# Altium schematic sheet 24. SOC DIGITAL POWER 3.SchDoc: SOC - DIGITAL POWER 3 (part 4 of 5)
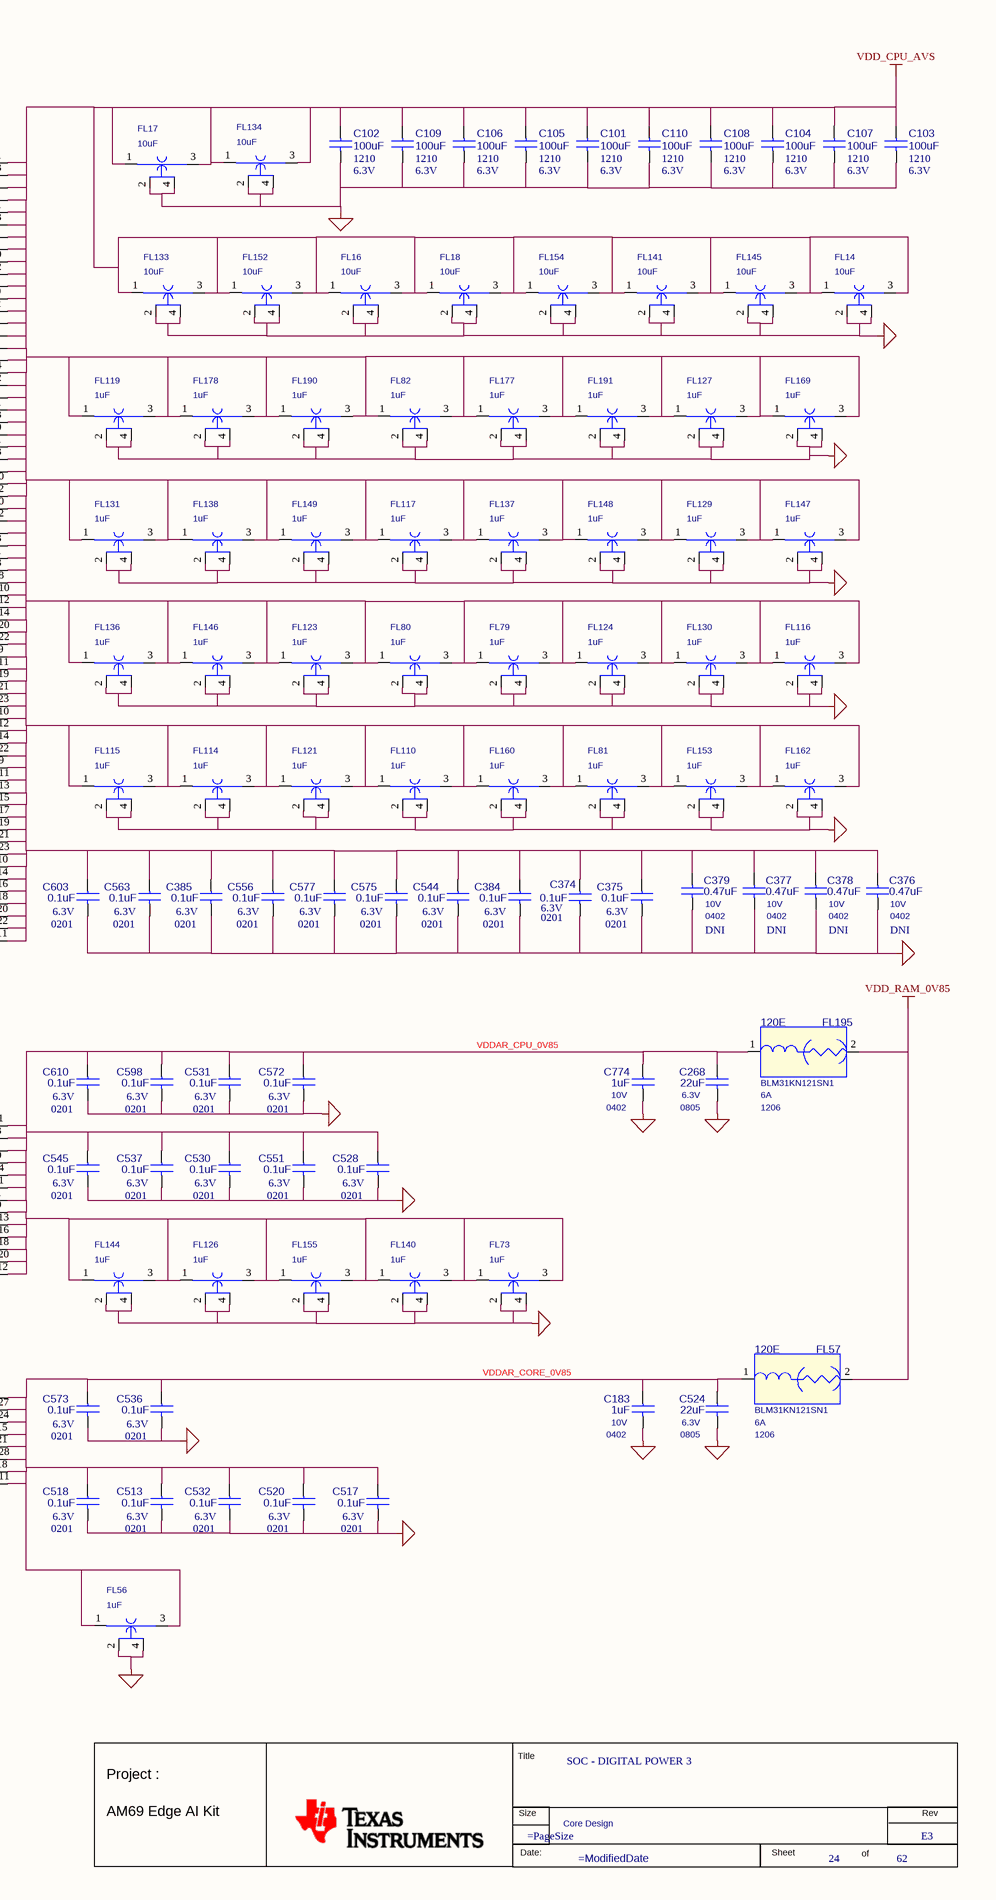
[diagram p4: 24. SOC DIGITAL POWER 3.SchDoc, right]

## Library data of the parts (continued)
FL108 = CAP_NFM_TI: PASSIVE FILTER EMI 1uF 4V AUTO 0402; Part Reference: FL108; Mfr_part_number: NFM15HC105D0G_TI; Mfr_name: MURATA; Mistral Part No: 130018100050; Custom_Duty: 15%; Customs_HS_Code: 85412900; Wattage: NA; Project: TI_J7ES_EVM_SOM; Value: 1uF; Footprint Path: Y:\MIS_DATABASE\Library\ALTIUM_TOOL\PCB_FOOTPRINTS\Altium_Footprint_Lib.PcbLib; Library Path: Y:\MIS_DATABASE\Library\ALTIUM_TOOL\SCHEMATICS_PARTS\MS_FILTER_Library.schlib; MECHANICAL 3D STEP FILE: EMIFIL_NFM15CC_0402_0-5_TI; RoHS: NA; Chkd/date: MANIRAJA/251018; Crtd /date: ALVY/251018; Datasheet: Y:\MIS_DATABASE\DATASHEETS\DISCRETES\INDUCTORS\NFM15CC223C1A3.PDF; Temperature: NA; Weight: NA; Height: 0.50MM; PCB Footprint: EMIFIL_NFM15CC_0402_0-5_TI; Library Ref: CAP_NFM_TI; Distributor_part_number: NA; Distributor_name: NA; Package: 0402; Voltage: 4V; Tolerance: NA; Part_type: FILTER; Footprint Ref: EMIFIL_NFM15CC_0402_0-5_TI
FL109 = CAP_NFM_TI: PASSIVE FILTER EMI 1uF 4V AUTO 0402; Part Reference: FL109; Mfr_part_number: NFM15HC105D0G_TI; Mfr_name: MURATA; Mistral Part No: 130018100050; Custom_Duty: 15%; Customs_HS_Code: 85412900; Wattage: NA; Project: TI_J7ES_EVM_SOM; Value: 1uF; Footprint Path: Y:\MIS_DATABASE\Library\ALTIUM_TOOL\PCB_FOOTPRINTS\Altium_Footprint_Lib.PcbLib; Library Path: Y:\MIS_DATABASE\Library\ALTIUM_TOOL\SCHEMATICS_PARTS\MS_FILTER_Library.schlib; MECHANICAL 3D STEP FILE: EMIFIL_NFM15CC_0402_0-5_TI; RoHS: NA; Chkd/date: MANIRAJA/251018; Crtd /date: ALVY/251018; Datasheet: Y:\MIS_DATABASE\DATASHEETS\DISCRETES\INDUCTORS\NFM15CC223C1A3.PDF; Temperature: NA; Weight: NA; Height: 0.50MM; PCB Footprint: EMIFIL_NFM15CC_0402_0-5_TI; Library Ref: CAP_NFM_TI; Distributor_part_number: NA; Distributor_name: NA; Package: 0402; Voltage: 4V; Tolerance: NA; Part_type: FILTER; Footprint Ref: EMIFIL_NFM15CC_0402_0-5_TI
FL110 = CAP_NFM_TI: PASSIVE FILTER EMI 1uF 4V AUTO 0402; Part Reference: FL110; Mfr_part_number: NFM15HC105D0G_TI; Mfr_name: MURATA; Mistral Part No: 130018100050; Custom_Duty: 15%; Customs_HS_Code: 85412900; Wattage: NA; Project: TI_J7ES_EVM_SOM; Value: 1uF; Footprint Path: Y:\MIS_DATABASE\Library\ALTIUM_TOOL\PCB_FOOTPRINTS\Altium_Footprint_Lib.PcbLib; Library Path: Y:\MIS_DATABASE\Library\ALTIUM_TOOL\SCHEMATICS_PARTS\MS_FILTER_Library.schlib; MECHANICAL 3D STEP FILE: EMIFIL_NFM15CC_0402_0-5_TI; RoHS: NA; Chkd/date: MANIRAJA/251018; Crtd /date: ALVY/251018; Datasheet: Y:\MIS_DATABASE\DATASHEETS\DISCRETES\INDUCTORS\NFM15CC223C1A3.PDF; Temperature: NA; Weight: NA; Height: 0.50MM; PCB Footprint: EMIFIL_NFM15CC_0402_0-5_TI; Library Ref: CAP_NFM_TI; Distributor_part_number: NA; Distributor_name: NA; Package: 0402; Voltage: 4V; Tolerance: NA; Part_type: FILTER; Footprint Ref: EMIFIL_NFM15CC_0402_0-5_TI
FL111 = CAP_NFM_TI: PASSIVE FILTER EMI 1uF 4V AUTO 0402; Part Reference: FL111; Mfr_part_number: NFM15HC105D0G_TI; Mfr_name: MURATA; Mistral Part No: 130018100050; Custom_Duty: 15%; Customs_HS_Code: 85412900; Wattage: NA; Project: TI_J7ES_EVM_SOM; Value: 1uF; Footprint Path: Y:\MIS_DATABASE\Library\ALTIUM_TOOL\PCB_FOOTPRINTS\Altium_Footprint_Lib.PcbLib; Library Path: Y:\MIS_DATABASE\Library\ALTIUM_TOOL\SCHEMATICS_PARTS\MS_FILTER_Library.schlib; MECHANICAL 3D STEP FILE: EMIFIL_NFM15CC_0402_0-5_TI; RoHS: NA; Chkd/date: MANIRAJA/251018; Crtd /date: ALVY/251018; Datasheet: Y:\MIS_DATABASE\DATASHEETS\DISCRETES\INDUCTORS\NFM15CC223C1A3.PDF; Temperature: NA; Weight: NA; Height: 0.50MM; PCB Footprint: EMIFIL_NFM15CC_0402_0-5_TI; Library Ref: CAP_NFM_TI; Distributor_part_number: NA; Distributor_name: NA; Package: 0402; Voltage: 4V; Tolerance: NA; Part_type: FILTER; Footprint Ref: EMIFIL_NFM15CC_0402_0-5_TI
FL112 = CAP_NFM_TI: PASSIVE FILTER EMI 1uF 4V AUTO 0402; Part Reference: FL112; Mfr_part_number: NFM15HC105D0G_TI; Mfr_name: MURATA; Mistral Part No: 130018100050; Custom_Duty: 15%; Customs_HS_Code: 85412900; Wattage: NA; Project: TI_J7ES_EVM_SOM; Value: 1uF; Footprint Path: Y:\MIS_DATABASE\Library\ALTIUM_TOOL\PCB_FOOTPRINTS\Altium_Footprint_Lib.PcbLib; Library Path: Y:\MIS_DATABASE\Library\ALTIUM_TOOL\SCHEMATICS_PARTS\MS_FILTER_Library.schlib; MECHANICAL 3D STEP FILE: EMIFIL_NFM15CC_0402_0-5_TI; RoHS: NA; Chkd/date: MANIRAJA/251018; Crtd /date: ALVY/251018; Datasheet: Y:\MIS_DATABASE\DATASHEETS\DISCRETES\INDUCTORS\NFM15CC223C1A3.PDF; Temperature: NA; Weight: NA; Height: 0.50MM; PCB Footprint: EMIFIL_NFM15CC_0402_0-5_TI; Library Ref: CAP_NFM_TI; Distributor_part_number: NA; Distributor_name: NA; Package: 0402; Voltage: 4V; Tolerance: NA; Part_type: FILTER; Footprint Ref: EMIFIL_NFM15CC_0402_0-5_TI
FL113 = CAP_NFM_TI: PASSIVE FILTER EMI 1uF 4V AUTO 0402; Part Reference: FL113; Mfr_part_number: NFM15HC105D0G_TI; Mfr_name: MURATA; Mistral Part No: 130018100050; Custom_Duty: 15%; Customs_HS_Code: 85412900; Wattage: NA; Project: TI_J7ES_EVM_SOM; Value: 1uF; Footprint Path: Y:\MIS_DATABASE\Library\ALTIUM_TOOL\PCB_FOOTPRINTS\Altium_Footprint_Lib.PcbLib; Library Path: Y:\MIS_DATABASE\Library\ALTIUM_TOOL\SCHEMATICS_PARTS\MS_FILTER_Library.schlib; MECHANICAL 3D STEP FILE: EMIFIL_NFM15CC_0402_0-5_TI; RoHS: NA; Chkd/date: MANIRAJA/251018; Crtd /date: ALVY/251018; Datasheet: Y:\MIS_DATABASE\DATASHEETS\DISCRETES\INDUCTORS\NFM15CC223C1A3.PDF; Temperature: NA; Weight: NA; Height: 0.50MM; PCB Footprint: EMIFIL_NFM15CC_0402_0-5_TI; Library Ref: CAP_NFM_TI; Distributor_part_number: NA; Distributor_name: NA; Package: 0402; Voltage: 4V; Tolerance: NA; Part_type: FILTER; Footprint Ref: EMIFIL_NFM15CC_0402_0-5_TI
FL114 = CAP_NFM_TI: PASSIVE FILTER EMI 1uF 4V AUTO 0402; Part Reference: FL114; Mfr_part_number: NFM15HC105D0G_TI; Mfr_name: MURATA; Mistral Part No: 130018100050; Custom_Duty: 15%; Customs_HS_Code: 85412900; Wattage: NA; Project: TI_J7ES_EVM_SOM; Value: 1uF; Footprint Path: Y:\MIS_DATABASE\Library\ALTIUM_TOOL\PCB_FOOTPRINTS\Altium_Footprint_Lib.PcbLib; Library Path: Y:\MIS_DATABASE\Library\ALTIUM_TOOL\SCHEMATICS_PARTS\MS_FILTER_Library.schlib; MECHANICAL 3D STEP FILE: EMIFIL_NFM15CC_0402_0-5_TI; RoHS: NA; Chkd/date: MANIRAJA/251018; Crtd /date: ALVY/251018; Datasheet: Y:\MIS_DATABASE\DATASHEETS\DISCRETES\INDUCTORS\NFM15CC223C1A3.PDF; Temperature: NA; Weight: NA; Height: 0.50MM; PCB Footprint: EMIFIL_NFM15CC_0402_0-5_TI; Library Ref: CAP_NFM_TI; Distributor_part_number: NA; Distributor_name: NA; Package: 0402; Voltage: 4V; Tolerance: NA; Part_type: FILTER; Footprint Ref: EMIFIL_NFM15CC_0402_0-5_TI
FL115 = CAP_NFM_TI: PASSIVE FILTER EMI 1uF 4V AUTO 0402; Part Reference: FL115; Mfr_part_number: NFM15HC105D0G_TI; Mfr_name: MURATA; Mistral Part No: 130018100050; Custom_Duty: 15%; Customs_HS_Code: 85412900; Wattage: NA; Project: TI_J7ES_EVM_SOM; Value: 1uF; Footprint Path: Y:\MIS_DATABASE\Library\ALTIUM_TOOL\PCB_FOOTPRINTS\Altium_Footprint_Lib.PcbLib; Library Path: Y:\MIS_DATABASE\Library\ALTIUM_TOOL\SCHEMATICS_PARTS\MS_FILTER_Library.schlib; MECHANICAL 3D STEP FILE: EMIFIL_NFM15CC_0402_0-5_TI; RoHS: NA; Chkd/date: MANIRAJA/251018; Crtd /date: ALVY/251018; Datasheet: Y:\MIS_DATABASE\DATASHEETS\DISCRETES\INDUCTORS\NFM15CC223C1A3.PDF; Temperature: NA; Weight: NA; Height: 0.50MM; PCB Footprint: EMIFIL_NFM15CC_0402_0-5_TI; Library Ref: CAP_NFM_TI; Distributor_part_number: NA; Distributor_name: NA; Package: 0402; Voltage: 4V; Tolerance: NA; Part_type: FILTER; Footprint Ref: EMIFIL_NFM15CC_0402_0-5_TI
FL116 = CAP_NFM_TI: PASSIVE FILTER EMI 1uF 4V AUTO 0402; Part Reference: FL116; Mfr_part_number: NFM15HC105D0G_TI; Mfr_name: MURATA; Mistral Part No: 130018100050; Custom_Duty: 15%; Customs_HS_Code: 85412900; Wattage: NA; Project: TI_J7ES_EVM_SOM; Value: 1uF; Footprint Path: Y:\MIS_DATABASE\Library\ALTIUM_TOOL\PCB_FOOTPRINTS\Altium_Footprint_Lib.PcbLib; Library Path: Y:\MIS_DATABASE\Library\ALTIUM_TOOL\SCHEMATICS_PARTS\MS_FILTER_Library.schlib; MECHANICAL 3D STEP FILE: EMIFIL_NFM15CC_0402_0-5_TI; RoHS: NA; Chkd/date: MANIRAJA/251018; Crtd /date: ALVY/251018; Datasheet: Y:\MIS_DATABASE\DATASHEETS\DISCRETES\INDUCTORS\NFM15CC223C1A3.PDF; Temperature: NA; Weight: NA; Height: 0.50MM; PCB Footprint: EMIFIL_NFM15CC_0402_0-5_TI; Library Ref: CAP_NFM_TI; Distributor_part_number: NA; Distributor_name: NA; Package: 0402; Voltage: 4V; Tolerance: NA; Part_type: FILTER; Footprint Ref: EMIFIL_NFM15CC_0402_0-5_TI
FL117 = CAP_NFM_TI: PASSIVE FILTER EMI 1uF 4V AUTO 0402; Part Reference: FL117; Mfr_part_number: NFM15HC105D0G_TI; Mfr_name: MURATA; Mistral Part No: 130018100050; Custom_Duty: 15%; Customs_HS_Code: 85412900; Wattage: NA; Project: TI_J7ES_EVM_SOM; Value: 1uF; Footprint Path: Y:\MIS_DATABASE\Library\ALTIUM_TOOL\PCB_FOOTPRINTS\Altium_Footprint_Lib.PcbLib; Library Path: Y:\MIS_DATABASE\Library\ALTIUM_TOOL\SCHEMATICS_PARTS\MS_FILTER_Library.schlib; MECHANICAL 3D STEP FILE: EMIFIL_NFM15CC_0402_0-5_TI; RoHS: NA; Chkd/date: MANIRAJA/251018; Crtd /date: ALVY/251018; Datasheet: Y:\MIS_DATABASE\DATASHEETS\DISCRETES\INDUCTORS\NFM15CC223C1A3.PDF; Temperature: NA; Weight: NA; Height: 0.50MM; PCB Footprint: EMIFIL_NFM15CC_0402_0-5_TI; Library Ref: CAP_NFM_TI; Distributor_part_number: NA; Distributor_name: NA; Package: 0402; Voltage: 4V; Tolerance: NA; Part_type: FILTER; Footprint Ref: EMIFIL_NFM15CC_0402_0-5_TI
FL118 = CAP_NFM_TI: PASSIVE FILTER EMI 1uF 4V AUTO 0402; Part Reference: FL118; Mfr_part_number: NFM15HC105D0G_TI; Mfr_name: MURATA; Mistral Part No: 130018100050; Custom_Duty: 15%; Customs_HS_Code: 85412900; Wattage: NA; Project: TI_J7ES_EVM_SOM; Value: 1uF; Footprint Path: Y:\MIS_DATABASE\Library\ALTIUM_TOOL\PCB_FOOTPRINTS\Altium_Footprint_Lib.PcbLib; Library Path: Y:\MIS_DATABASE\Library\ALTIUM_TOOL\SCHEMATICS_PARTS\MS_FILTER_Library.schlib; MECHANICAL 3D STEP FILE: EMIFIL_NFM15CC_0402_0-5_TI; RoHS: NA; Chkd/date: MANIRAJA/251018; Crtd /date: ALVY/251018; Datasheet: Y:\MIS_DATABASE\DATASHEETS\DISCRETES\INDUCTORS\NFM15CC223C1A3.PDF; Temperature: NA; Weight: NA; Height: 0.50MM; PCB Footprint: EMIFIL_NFM15CC_0402_0-5_TI; Library Ref: CAP_NFM_TI; Distributor_part_number: NA; Distributor_name: NA; Package: 0402; Voltage: 4V; Tolerance: NA; Part_type: FILTER; Footprint Ref: EMIFIL_NFM15CC_0402_0-5_TI
FL119 = CAP_NFM_TI: PASSIVE FILTER EMI 1uF 4V AUTO 0402; Part Reference: FL119; Mfr_part_number: NFM15HC105D0G_TI; Mfr_name: MURATA; Mistral Part No: 130018100050; Custom_Duty: 15%; Customs_HS_Code: 85412900; Wattage: NA; Project: TI_J7ES_EVM_SOM; Value: 1uF; Footprint Path: Y:\MIS_DATABASE\Library\ALTIUM_TOOL\PCB_FOOTPRINTS\Altium_Footprint_Lib.PcbLib; Library Path: Y:\MIS_DATABASE\Library\ALTIUM_TOOL\SCHEMATICS_PARTS\MS_FILTER_Library.schlib; MECHANICAL 3D STEP FILE: EMIFIL_NFM15CC_0402_0-5_TI; RoHS: NA; Chkd/date: MANIRAJA/251018; Crtd /date: ALVY/251018; Datasheet: Y:\MIS_DATABASE\DATASHEETS\DISCRETES\INDUCTORS\NFM15CC223C1A3.PDF; Temperature: NA; Weight: NA; Height: 0.50MM; PCB Footprint: EMIFIL_NFM15CC_0402_0-5_TI; Library Ref: CAP_NFM_TI; Distributor_part_number: NA; Distributor_name: NA; Package: 0402; Voltage: 4V; Tolerance: NA; Part_type: FILTER; Footprint Ref: EMIFIL_NFM15CC_0402_0-5_TI
FL120 = CAP_NFM_TI: PASSIVE FILTER EMI 1uF 4V AUTO 0402; Part Reference: FL120; Mfr_part_number: NFM15HC105D0G_TI; Mfr_name: MURATA; Mistral Part No: 130018100050; Custom_Duty: 15%; Customs_HS_Code: 85412900; Wattage: NA; Project: TI_J7ES_EVM_SOM; Value: 1uF; Footprint Path: Y:\MIS_DATABASE\Library\ALTIUM_TOOL\PCB_FOOTPRINTS\Altium_Footprint_Lib.PcbLib; Library Path: Y:\MIS_DATABASE\Library\ALTIUM_TOOL\SCHEMATICS_PARTS\MS_FILTER_Library.schlib; MECHANICAL 3D STEP FILE: EMIFIL_NFM15CC_0402_0-5_TI; RoHS: NA; Chkd/date: MANIRAJA/251018; Crtd /date: ALVY/251018; Datasheet: Y:\MIS_DATABASE\DATASHEETS\DISCRETES\INDUCTORS\NFM15CC223C1A3.PDF; Temperature: NA; Weight: NA; Height: 0.50MM; PCB Footprint: EMIFIL_NFM15CC_0402_0-5_TI; Library Ref: CAP_NFM_TI; Distributor_part_number: NA; Distributor_name: NA; Package: 0402; Voltage: 4V; Tolerance: NA; Part_type: FILTER; Footprint Ref: EMIFIL_NFM15CC_0402_0-5_TI
FL121 = CAP_NFM_TI: PASSIVE FILTER EMI 1uF 4V AUTO 0402; Part Reference: FL121; Mfr_part_number: NFM15HC105D0G_TI; Mfr_name: MURATA; Mistral Part No: 130018100050; Custom_Duty: 15%; Customs_HS_Code: 85412900; Wattage: NA; Project: TI_J7ES_EVM_SOM; Value: 1uF; Footprint Path: Y:\MIS_DATABASE\Library\ALTIUM_TOOL\PCB_FOOTPRINTS\Altium_Footprint_Lib.PcbLib; Library Path: Y:\MIS_DATABASE\Library\ALTIUM_TOOL\SCHEMATICS_PARTS\MS_FILTER_Library.schlib; MECHANICAL 3D STEP FILE: EMIFIL_NFM15CC_0402_0-5_TI; RoHS: NA; Chkd/date: MANIRAJA/251018; Crtd /date: ALVY/251018; Datasheet: Y:\MIS_DATABASE\DATASHEETS\DISCRETES\INDUCTORS\NFM15CC223C1A3.PDF; Temperature: NA; Weight: NA; Height: 0.50MM; PCB Footprint: EMIFIL_NFM15CC_0402_0-5_TI; Library Ref: CAP_NFM_TI; Distributor_part_number: NA; Distributor_name: NA; Package: 0402; Voltage: 4V; Tolerance: NA; Part_type: FILTER; Footprint Ref: EMIFIL_NFM15CC_0402_0-5_TI
FL122 = CAP_NFM_TI: PASSIVE FILTER EMI 1uF 4V AUTO 0402; Part Reference: FL122; Mfr_part_number: NFM15HC105D0G_TI; Mfr_name: MURATA; Mistral Part No: 130018100050; Custom_Duty: 15%; Customs_HS_Code: 85412900; Wattage: NA; Project: TI_J7ES_EVM_SOM; Value: 1uF; Footprint Path: Y:\MIS_DATABASE\Library\ALTIUM_TOOL\PCB_FOOTPRINTS\Altium_Footprint_Lib.PcbLib; Library Path: Y:\MIS_DATABASE\Library\ALTIUM_TOOL\SCHEMATICS_PARTS\MS_FILTER_Library.schlib; MECHANICAL 3D STEP FILE: EMIFIL_NFM15CC_0402_0-5_TI; RoHS: NA; Chkd/date: MANIRAJA/251018; Crtd /date: ALVY/251018; Datasheet: Y:\MIS_DATABASE\DATASHEETS\DISCRETES\INDUCTORS\NFM15CC223C1A3.PDF; Temperature: NA; Weight: NA; Height: 0.50MM; PCB Footprint: EMIFIL_NFM15CC_0402_0-5_TI; Library Ref: CAP_NFM_TI; Distributor_part_number: NA; Distributor_name: NA; Package: 0402; Voltage: 4V; Tolerance: NA; Part_type: FILTER; Footprint Ref: EMIFIL_NFM15CC_0402_0-5_TI
FL123 = CAP_NFM_TI: PASSIVE FILTER EMI 1uF 4V AUTO 0402; Part Reference: FL123; Mfr_part_number: NFM15HC105D0G_TI; Mfr_name: MURATA; Mistral Part No: 130018100050; Custom_Duty: 15%; Customs_HS_Code: 85412900; Wattage: NA; Project: TI_J7ES_EVM_SOM; Value: 1uF; Footprint Path: Y:\MIS_DATABASE\Library\ALTIUM_TOOL\PCB_FOOTPRINTS\Altium_Footprint_Lib.PcbLib; Library Path: Y:\MIS_DATABASE\Library\ALTIUM_TOOL\SCHEMATICS_PARTS\MS_FILTER_Library.schlib; MECHANICAL 3D STEP FILE: EMIFIL_NFM15CC_0402_0-5_TI; RoHS: NA; Chkd/date: MANIRAJA/251018; Crtd /date: ALVY/251018; Datasheet: Y:\MIS_DATABASE\DATASHEETS\DISCRETES\INDUCTORS\NFM15CC223C1A3.PDF; Temperature: NA; Weight: NA; Height: 0.50MM; PCB Footprint: EMIFIL_NFM15CC_0402_0-5_TI; Library Ref: CAP_NFM_TI; Distributor_part_number: NA; Distributor_name: NA; Package: 0402; Voltage: 4V; Tolerance: NA; Part_type: FILTER; Footprint Ref: EMIFIL_NFM15CC_0402_0-5_TI
FL124 = CAP_NFM_TI: PASSIVE FILTER EMI 1uF 4V AUTO 0402; Part Reference: FL124; Mfr_part_number: NFM15HC105D0G_TI; Mfr_name: MURATA; Mistral Part No: 130018100050; Custom_Duty: 15%; Customs_HS_Code: 85412900; Wattage: NA; Project: TI_J7ES_EVM_SOM; Value: 1uF; Footprint Path: Y:\MIS_DATABASE\Library\ALTIUM_TOOL\PCB_FOOTPRINTS\Altium_Footprint_Lib.PcbLib; Library Path: Y:\MIS_DATABASE\Library\ALTIUM_TOOL\SCHEMATICS_PARTS\MS_FILTER_Library.schlib; MECHANICAL 3D STEP FILE: EMIFIL_NFM15CC_0402_0-5_TI; RoHS: NA; Chkd/date: MANIRAJA/251018; Crtd /date: ALVY/251018; Datasheet: Y:\MIS_DATABASE\DATASHEETS\DISCRETES\INDUCTORS\NFM15CC223C1A3.PDF; Temperature: NA; Weight: NA; Height: 0.50MM; PCB Footprint: EMIFIL_NFM15CC_0402_0-5_TI; Library Ref: CAP_NFM_TI; Distributor_part_number: NA; Distributor_name: NA; Package: 0402; Voltage: 4V; Tolerance: NA; Part_type: FILTER; Footprint Ref: EMIFIL_NFM15CC_0402_0-5_TI
FL125 = CAP_NFM_TI: PASSIVE FILTER EMI 1uF 4V AUTO 0402; Part Reference: FL125; Mfr_part_number: NFM15HC105D0G_TI; Mfr_name: MURATA; Mistral Part No: 130018100050; Custom_Duty: 15%; Customs_HS_Code: 85412900; Wattage: NA; Project: TI_J7ES_EVM_SOM; Value: 1uF; Footprint Path: Y:\MIS_DATABASE\Library\ALTIUM_TOOL\PCB_FOOTPRINTS\Altium_Footprint_Lib.PcbLib; Library Path: Y:\MIS_DATABASE\Library\ALTIUM_TOOL\SCHEMATICS_PARTS\MS_FILTER_Library.schlib; MECHANICAL 3D STEP FILE: EMIFIL_NFM15CC_0402_0-5_TI; RoHS: NA; Chkd/date: MANIRAJA/251018; Crtd /date: ALVY/251018; Datasheet: Y:\MIS_DATABASE\DATASHEETS\DISCRETES\INDUCTORS\NFM15CC223C1A3.PDF; Temperature: NA; Weight: NA; Height: 0.50MM; PCB Footprint: EMIFIL_NFM15CC_0402_0-5_TI; Library Ref: CAP_NFM_TI; Distributor_part_number: NA; Distributor_name: NA; Package: 0402; Voltage: 4V; Tolerance: NA; Part_type: FILTER; Footprint Ref: EMIFIL_NFM15CC_0402_0-5_TI
FL126 = CAP_NFM_TI: PASSIVE FILTER EMI 1uF 4V AUTO 0402; Part Reference: FL126; Mfr_part_number: NFM15HC105D0G_TI; Mfr_name: MURATA; Mistral Part No: 130018100050; Custom_Duty: 15%; Customs_HS_Code: 85412900; Wattage: NA; Project: TI_J7ES_EVM_SOM; Value: 1uF; Footprint Path: Y:\MIS_DATABASE\Library\ALTIUM_TOOL\PCB_FOOTPRINTS\Altium_Footprint_Lib.PcbLib; Library Path: Y:\MIS_DATABASE\Library\ALTIUM_TOOL\SCHEMATICS_PARTS\MS_FILTER_Library.schlib; MECHANICAL 3D STEP FILE: EMIFIL_NFM15CC_0402_0-5_TI; RoHS: NA; Chkd/date: MANIRAJA/251018; Crtd /date: ALVY/251018; Datasheet: Y:\MIS_DATABASE\DATASHEETS\DISCRETES\INDUCTORS\NFM15CC223C1A3.PDF; Temperature: NA; Weight: NA; Height: 0.50MM; PCB Footprint: EMIFIL_NFM15CC_0402_0-5_TI; Library Ref: CAP_NFM_TI; Distributor_part_number: NA; Distributor_name: NA; Package: 0402; Voltage: 4V; Tolerance: NA; Part_type: FILTER; Footprint Ref: EMIFIL_NFM15CC_0402_0-5_TI
FL127 = CAP_NFM_TI: PASSIVE FILTER EMI 1uF 4V AUTO 0402; Part Reference: FL127; Mfr_part_number: NFM15HC105D0G_TI; Mfr_name: MURATA; Mistral Part No: 130018100050; Custom_Duty: 15%; Customs_HS_Code: 85412900; Wattage: NA; Project: TI_J7ES_EVM_SOM; Value: 1uF; Footprint Path: Y:\MIS_DATABASE\Library\ALTIUM_TOOL\PCB_FOOTPRINTS\Altium_Footprint_Lib.PcbLib; Library Path: Y:\MIS_DATABASE\Library\ALTIUM_TOOL\SCHEMATICS_PARTS\MS_FILTER_Library.schlib; MECHANICAL 3D STEP FILE: EMIFIL_NFM15CC_0402_0-5_TI; RoHS: NA; Chkd/date: MANIRAJA/251018; Crtd /date: ALVY/251018; Datasheet: Y:\MIS_DATABASE\DATASHEETS\DISCRETES\INDUCTORS\NFM15CC223C1A3.PDF; Temperature: NA; Weight: NA; Height: 0.50MM; PCB Footprint: EMIFIL_NFM15CC_0402_0-5_TI; Library Ref: CAP_NFM_TI; Distributor_part_number: NA; Distributor_name: NA; Package: 0402; Voltage: 4V; Tolerance: NA; Part_type: FILTER; Footprint Ref: EMIFIL_NFM15CC_0402_0-5_TI
FL128 = CAP_NFM_TI: PASSIVE FILTER EMI 1uF 4V AUTO 0402; Part Reference: FL128; Mfr_part_number: NFM15HC105D0G_TI; Mfr_name: MURATA; Mistral Part No: 130018100050; Custom_Duty: 15%; Customs_HS_Code: 85412900; Wattage: NA; Project: TI_J7ES_EVM_SOM; Value: 1uF; Footprint Path: Y:\MIS_DATABASE\Library\ALTIUM_TOOL\PCB_FOOTPRINTS\Altium_Footprint_Lib.PcbLib; Library Path: Y:\MIS_DATABASE\Library\ALTIUM_TOOL\SCHEMATICS_PARTS\MS_FILTER_Library.schlib; MECHANICAL 3D STEP FILE: EMIFIL_NFM15CC_0402_0-5_TI; RoHS: NA; Chkd/date: MANIRAJA/251018; Crtd /date: ALVY/251018; Datasheet: Y:\MIS_DATABASE\DATASHEETS\DISCRETES\INDUCTORS\NFM15CC223C1A3.PDF; Temperature: NA; Weight: NA; Height: 0.50MM; PCB Footprint: EMIFIL_NFM15CC_0402_0-5_TI; Library Ref: CAP_NFM_TI; Distributor_part_number: NA; Distributor_name: NA; Package: 0402; Voltage: 4V; Tolerance: NA; Part_type: FILTER; Footprint Ref: EMIFIL_NFM15CC_0402_0-5_TI
FL129 = CAP_NFM_TI: PASSIVE FILTER EMI 1uF 4V AUTO 0402; Part Reference: FL129; Mfr_part_number: NFM15HC105D0G_TI; Mfr_name: MURATA; Mistral Part No: 130018100050; Custom_Duty: 15%; Customs_HS_Code: 85412900; Wattage: NA; Project: TI_J7ES_EVM_SOM; Value: 1uF; Footprint Path: Y:\MIS_DATABASE\Library\ALTIUM_TOOL\PCB_FOOTPRINTS\Altium_Footprint_Lib.PcbLib; Library Path: Y:\MIS_DATABASE\Library\ALTIUM_TOOL\SCHEMATICS_PARTS\MS_FILTER_Library.schlib; MECHANICAL 3D STEP FILE: EMIFIL_NFM15CC_0402_0-5_TI; RoHS: NA; Chkd/date: MANIRAJA/251018; Crtd /date: ALVY/251018; Datasheet: Y:\MIS_DATABASE\DATASHEETS\DISCRETES\INDUCTORS\NFM15CC223C1A3.PDF; Temperature: NA; Weight: NA; Height: 0.50MM; PCB Footprint: EMIFIL_NFM15CC_0402_0-5_TI; Library Ref: CAP_NFM_TI; Distributor_part_number: NA; Distributor_name: NA; Package: 0402; Voltage: 4V; Tolerance: NA; Part_type: FILTER; Footprint Ref: EMIFIL_NFM15CC_0402_0-5_TI
FL130 = CAP_NFM_TI: PASSIVE FILTER EMI 1uF 4V AUTO 0402; Part Reference: FL130; Mfr_part_number: NFM15HC105D0G_TI; Mfr_name: MURATA; Mistral Part No: 130018100050; Custom_Duty: 15%; Customs_HS_Code: 85412900; Wattage: NA; Project: TI_J7ES_EVM_SOM; Value: 1uF; Footprint Path: Y:\MIS_DATABASE\Library\ALTIUM_TOOL\PCB_FOOTPRINTS\Altium_Footprint_Lib.PcbLib; Library Path: Y:\MIS_DATABASE\Library\ALTIUM_TOOL\SCHEMATICS_PARTS\MS_FILTER_Library.schlib; MECHANICAL 3D STEP FILE: EMIFIL_NFM15CC_0402_0-5_TI; RoHS: NA; Chkd/date: MANIRAJA/251018; Crtd /date: ALVY/251018; Datasheet: Y:\MIS_DATABASE\DATASHEETS\DISCRETES\INDUCTORS\NFM15CC223C1A3.PDF; Temperature: NA; Weight: NA; Height: 0.50MM; PCB Footprint: EMIFIL_NFM15CC_0402_0-5_TI; Library Ref: CAP_NFM_TI; Distributor_part_number: NA; Distributor_name: NA; Package: 0402; Voltage: 4V; Tolerance: NA; Part_type: FILTER; Footprint Ref: EMIFIL_NFM15CC_0402_0-5_TI
FL131 = CAP_NFM_TI: PASSIVE FILTER EMI 1uF 4V AUTO 0402; Part Reference: FL131; Mfr_part_number: NFM15HC105D0G_TI; Mfr_name: MURATA; Mistral Part No: 130018100050; Custom_Duty: 15%; Customs_HS_Code: 85412900; Wattage: NA; Project: TI_J7ES_EVM_SOM; Value: 1uF; Footprint Path: Y:\MIS_DATABASE\Library\ALTIUM_TOOL\PCB_FOOTPRINTS\Altium_Footprint_Lib.PcbLib; Library Path: Y:\MIS_DATABASE\Library\ALTIUM_TOOL\SCHEMATICS_PARTS\MS_FILTER_Library.schlib; MECHANICAL 3D STEP FILE: EMIFIL_NFM15CC_0402_0-5_TI; RoHS: NA; Chkd/date: MANIRAJA/251018; Crtd /date: ALVY/251018; Datasheet: Y:\MIS_DATABASE\DATASHEETS\DISCRETES\INDUCTORS\NFM15CC223C1A3.PDF; Temperature: NA; Weight: NA; Height: 0.50MM; PCB Footprint: EMIFIL_NFM15CC_0402_0-5_TI; Library Ref: CAP_NFM_TI; Distributor_part_number: NA; Distributor_name: NA; Package: 0402; Voltage: 4V; Tolerance: NA; Part_type: FILTER; Footprint Ref: EMIFIL_NFM15CC_0402_0-5_TI
FL132 = CAP_NFM_TI: PASSIVE FILTER EMI 1uF 4V AUTO 0402; Part Reference: FL132; Mfr_part_number: NFM15HC105D0G_TI; Mfr_name: MURATA; Mistral Part No: 130018100050; Custom_Duty: 15%; Customs_HS_Code: 85412900; Wattage: NA; Project: TI_J7ES_EVM_SOM; Value: 1uF; Footprint Path: Y:\MIS_DATABASE\Library\ALTIUM_TOOL\PCB_FOOTPRINTS\Altium_Footprint_Lib.PcbLib; Library Path: Y:\MIS_DATABASE\Library\ALTIUM_TOOL\SCHEMATICS_PARTS\MS_FILTER_Library.schlib; MECHANICAL 3D STEP FILE: EMIFIL_NFM15CC_0402_0-5_TI; RoHS: NA; Chkd/date: MANIRAJA/251018; Crtd /date: ALVY/251018; Datasheet: Y:\MIS_DATABASE\DATASHEETS\DISCRETES\INDUCTORS\NFM15CC223C1A3.PDF; Temperature: NA; Weight: NA; Height: 0.50MM; PCB Footprint: EMIFIL_NFM15CC_0402_0-5_TI; Library Ref: CAP_NFM_TI; Distributor_part_number: NA; Distributor_name: NA; Package: 0402; Voltage: 4V; Tolerance: NA; Part_type: FILTER; Footprint Ref: EMIFIL_NFM15CC_0402_0-5_TI
FL133 = CAP_NFM_TI: PASSIVE FILTER EMI 10uF 4V AUTO 0603; Part Reference: FL133; Mfr_part_number: NFM18HC106D0G_TI; Mfr_name: MURATA; Mistral Part No: 130018100049; Custom_Duty: 15%; Customs_HS_Code: 85412900; Wattage: NA; Project: TI_J7ES_EVM_SOM; Value: 10uF; Footprint Path: Y:\MIS_DATABASE\Library\ALTIUM_TOOL\PCB_FOOTPRINTS\Altium_Footprint_Lib.PcbLib; Library Path: Y:\MIS_DATABASE\Library\ALTIUM_TOOL\SCHEMATICS_PARTS\MS_FILTER_Library.schlib; MECHANICAL 3D STEP FILE: EMIFIL_NFM18C_0603_0-7_TI; RoHS: NA; Chkd/date: MANIRAJA/251018; Crtd /date: ALVY/251018; Datasheet: Y:\MIS_DATABASE\DATASHEETS\DISCRETES\INDUCTORS\NFM18HC-SER.PDF; Temperature: NA; Weight: NA; Height: 0.70MM; PCB Footprint: EMIFIL_NFM18C_0603_0-7_TI; Library Ref: CAP_NFM_TI; Distributor_part_number: NA; Distributor_name: NA; Package: 0603; Voltage: 4V; Tolerance: NA; Part_type: FILTER; Footprint Ref: EMIFIL_NFM18C_0603_0-7_TI
FL134 = CAP_NFM_TI: PASSIVE FILTER EMI 10uF 4V AUTO 0603; Part Reference: FL134; Mfr_part_number: NFM18HC106D0G_TI; Mfr_name: MURATA; Mistral Part No: 130018100049; Custom_Duty: 15%; Customs_HS_Code: 85412900; Wattage: NA; Project: TI_J7ES_EVM_SOM; Value: 10uF; Footprint Path: Y:\MIS_DATABASE\Library\ALTIUM_TOOL\PCB_FOOTPRINTS\Altium_Footprint_Lib.PcbLib; Library Path: Y:\MIS_DATABASE\Library\ALTIUM_TOOL\SCHEMATICS_PARTS\MS_FILTER_Library.schlib; MECHANICAL 3D STEP FILE: EMIFIL_NFM18C_0603_0-7_TI; RoHS: NA; Chkd/date: MANIRAJA/251018; Crtd /date: ALVY/251018; Datasheet: Y:\MIS_DATABASE\DATASHEETS\DISCRETES\INDUCTORS\NFM18HC-SER.PDF; Temperature: NA; Weight: NA; Height: 0.70MM; PCB Footprint: EMIFIL_NFM18C_0603_0-7_TI; Library Ref: CAP_NFM_TI; Distributor_part_number: NA; Distributor_name: NA; Package: 0603; Voltage: 4V; Tolerance: NA; Part_type: FILTER; Footprint Ref: EMIFIL_NFM18C_0603_0-7_TI
FL135 = CAP_NFM_TI: PASSIVE FILTER EMI 1uF 4V AUTO 0402; Part Reference: FL135; Mfr_part_number: NFM15HC105D0G_TI; Mfr_name: MURATA; Mistral Part No: 130018100050; Custom_Duty: 15%; Customs_HS_Code: 85412900; Wattage: NA; Project: TI_J7ES_EVM_SOM; Value: 1uF; Footprint Path: Y:\MIS_DATABASE\Library\ALTIUM_TOOL\PCB_FOOTPRINTS\Altium_Footprint_Lib.PcbLib; Library Path: Y:\MIS_DATABASE\Library\ALTIUM_TOOL\SCHEMATICS_PARTS\MS_FILTER_Library.schlib; MECHANICAL 3D STEP FILE: EMIFIL_NFM15CC_0402_0-5_TI; RoHS: NA; Chkd/date: MANIRAJA/251018; Crtd /date: ALVY/251018; Datasheet: Y:\MIS_DATABASE\DATASHEETS\DISCRETES\INDUCTORS\NFM15CC223C1A3.PDF; Temperature: NA; Weight: NA; Height: 0.50MM; PCB Footprint: EMIFIL_NFM15CC_0402_0-5_TI; Library Ref: CAP_NFM_TI; Distributor_part_number: NA; Distributor_name: NA; Package: 0402; Voltage: 4V; Tolerance: NA; Part_type: FILTER; Footprint Ref: EMIFIL_NFM15CC_0402_0-5_TI
FL136 = CAP_NFM_TI: PASSIVE FILTER EMI 1uF 4V AUTO 0402; Part Reference: FL136; Mfr_part_number: NFM15HC105D0G_TI; Mfr_name: MURATA; Mistral Part No: 130018100050; Custom_Duty: 15%; Customs_HS_Code: 85412900; Wattage: NA; Project: TI_J7ES_EVM_SOM; Value: 1uF; Footprint Path: Y:\MIS_DATABASE\Library\ALTIUM_TOOL\PCB_FOOTPRINTS\Altium_Footprint_Lib.PcbLib; Library Path: Y:\MIS_DATABASE\Library\ALTIUM_TOOL\SCHEMATICS_PARTS\MS_FILTER_Library.schlib; MECHANICAL 3D STEP FILE: EMIFIL_NFM15CC_0402_0-5_TI; RoHS: NA; Chkd/date: MANIRAJA/251018; Crtd /date: ALVY/251018; Datasheet: Y:\MIS_DATABASE\DATASHEETS\DISCRETES\INDUCTORS\NFM15CC223C1A3.PDF; Temperature: NA; Weight: NA; Height: 0.50MM; PCB Footprint: EMIFIL_NFM15CC_0402_0-5_TI; Library Ref: CAP_NFM_TI; Distributor_part_number: NA; Distributor_name: NA; Package: 0402; Voltage: 4V; Tolerance: NA; Part_type: FILTER; Footprint Ref: EMIFIL_NFM15CC_0402_0-5_TI
FL137 = CAP_NFM_TI: PASSIVE FILTER EMI 1uF 4V AUTO 0402; Part Reference: FL137; Mfr_part_number: NFM15HC105D0G_TI; Mfr_name: MURATA; Mistral Part No: 130018100050; Custom_Duty: 15%; Customs_HS_Code: 85412900; Wattage: NA; Project: TI_J7ES_EVM_SOM; Value: 1uF; Footprint Path: Y:\MIS_DATABASE\Library\ALTIUM_TOOL\PCB_FOOTPRINTS\Altium_Footprint_Lib.PcbLib; Library Path: Y:\MIS_DATABASE\Library\ALTIUM_TOOL\SCHEMATICS_PARTS\MS_FILTER_Library.schlib; MECHANICAL 3D STEP FILE: EMIFIL_NFM15CC_0402_0-5_TI; RoHS: NA; Chkd/date: MANIRAJA/251018; Crtd /date: ALVY/251018; Datasheet: Y:\MIS_DATABASE\DATASHEETS\DISCRETES\INDUCTORS\NFM15CC223C1A3.PDF; Temperature: NA; Weight: NA; Height: 0.50MM; PCB Footprint: EMIFIL_NFM15CC_0402_0-5_TI; Library Ref: CAP_NFM_TI; Distributor_part_number: NA; Distributor_name: NA; Package: 0402; Voltage: 4V; Tolerance: NA; Part_type: FILTER; Footprint Ref: EMIFIL_NFM15CC_0402_0-5_TI
FL138 = CAP_NFM_TI: PASSIVE FILTER EMI 1uF 4V AUTO 0402; Part Reference: FL138; Mfr_part_number: NFM15HC105D0G_TI; Mfr_name: MURATA; Mistral Part No: 130018100050; Custom_Duty: 15%; Customs_HS_Code: 85412900; Wattage: NA; Project: TI_J7ES_EVM_SOM; Value: 1uF; Footprint Path: Y:\MIS_DATABASE\Library\ALTIUM_TOOL\PCB_FOOTPRINTS\Altium_Footprint_Lib.PcbLib; Library Path: Y:\MIS_DATABASE\Library\ALTIUM_TOOL\SCHEMATICS_PARTS\MS_FILTER_Library.schlib; MECHANICAL 3D STEP FILE: EMIFIL_NFM15CC_0402_0-5_TI; RoHS: NA; Chkd/date: MANIRAJA/251018; Crtd /date: ALVY/251018; Datasheet: Y:\MIS_DATABASE\DATASHEETS\DISCRETES\INDUCTORS\NFM15CC223C1A3.PDF; Temperature: NA; Weight: NA; Height: 0.50MM; PCB Footprint: EMIFIL_NFM15CC_0402_0-5_TI; Library Ref: CAP_NFM_TI; Distributor_part_number: NA; Distributor_name: NA; Package: 0402; Voltage: 4V; Tolerance: NA; Part_type: FILTER; Footprint Ref: EMIFIL_NFM15CC_0402_0-5_TI
FL139 = CAP_NFM_TI: PASSIVE FILTER EMI 1uF 4V AUTO 0402; Part Reference: FL139; Mfr_part_number: NFM15HC105D0G_TI; Mfr_name: MURATA; Mistral Part No: 130018100050; Custom_Duty: 15%; Customs_HS_Code: 85412900; Wattage: NA; Project: TI_J7ES_EVM_SOM; Value: 1uF; Footprint Path: Y:\MIS_DATABASE\Library\ALTIUM_TOOL\PCB_FOOTPRINTS\Altium_Footprint_Lib.PcbLib; Library Path: Y:\MIS_DATABASE\Library\ALTIUM_TOOL\SCHEMATICS_PARTS\MS_FILTER_Library.schlib; MECHANICAL 3D STEP FILE: EMIFIL_NFM15CC_0402_0-5_TI; RoHS: NA; Chkd/date: MANIRAJA/251018; Crtd /date: ALVY/251018; Datasheet: Y:\MIS_DATABASE\DATASHEETS\DISCRETES\INDUCTORS\NFM15CC223C1A3.PDF; Temperature: NA; Weight: NA; Height: 0.50MM; PCB Footprint: EMIFIL_NFM15CC_0402_0-5_TI; Library Ref: CAP_NFM_TI; Distributor_part_number: NA; Distributor_name: NA; Package: 0402; Voltage: 4V; Tolerance: NA; Part_type: FILTER; Footprint Ref: EMIFIL_NFM15CC_0402_0-5_TI
FL140 = CAP_NFM_TI: PASSIVE FILTER EMI 1uF 4V AUTO 0402; Part Reference: FL140; Mfr_part_number: NFM15HC105D0G_TI; Mfr_name: MURATA; Mistral Part No: 130018100050; Custom_Duty: 15%; Customs_HS_Code: 85412900; Wattage: NA; Project: TI_J7ES_EVM_SOM; Value: 1uF; Footprint Path: Y:\MIS_DATABASE\Library\ALTIUM_TOOL\PCB_FOOTPRINTS\Altium_Footprint_Lib.PcbLib; Library Path: Y:\MIS_DATABASE\Library\ALTIUM_TOOL\SCHEMATICS_PARTS\MS_FILTER_Library.schlib; MECHANICAL 3D STEP FILE: EMIFIL_NFM15CC_0402_0-5_TI; RoHS: NA; Chkd/date: MANIRAJA/251018; Crtd /date: ALVY/251018; Datasheet: Y:\MIS_DATABASE\DATASHEETS\DISCRETES\INDUCTORS\NFM15CC223C1A3.PDF; Temperature: NA; Weight: NA; Height: 0.50MM; PCB Footprint: EMIFIL_NFM15CC_0402_0-5_TI; Library Ref: CAP_NFM_TI; Distributor_part_number: NA; Distributor_name: NA; Package: 0402; Voltage: 4V; Tolerance: NA; Part_type: FILTER; Footprint Ref: EMIFIL_NFM15CC_0402_0-5_TI
FL141 = CAP_NFM_TI: PASSIVE FILTER EMI 10uF 4V AUTO 0603; Part Reference: FL141; Mfr_part_number: NFM18HC106D0G_TI; Mfr_name: MURATA; Mistral Part No: 130018100049; Custom_Duty: 15%; Customs_HS_Code: 85412900; Wattage: NA; Project: TI_J7ES_EVM_SOM; Value: 10uF; Footprint Path: Y:\MIS_DATABASE\Library\ALTIUM_TOOL\PCB_FOOTPRINTS\Altium_Footprint_Lib.PcbLib; Library Path: Y:\MIS_DATABASE\Library\ALTIUM_TOOL\SCHEMATICS_PARTS\MS_FILTER_Library.schlib; MECHANICAL 3D STEP FILE: EMIFIL_NFM18C_0603_0-7_TI; RoHS: NA; Chkd/date: MANIRAJA/251018; Crtd /date: ALVY/251018; Datasheet: Y:\MIS_DATABASE\DATASHEETS\DISCRETES\INDUCTORS\NFM18HC-SER.PDF; Temperature: NA; Weight: NA; Height: 0.70MM; PCB Footprint: EMIFIL_NFM18C_0603_0-7_TI; Library Ref: CAP_NFM_TI; Distributor_part_number: NA; Distributor_name: NA; Package: 0603; Voltage: 4V; Tolerance: NA; Part_type: FILTER; Footprint Ref: EMIFIL_NFM18C_0603_0-7_TI
FL142 = CAP_NFM_TI: PASSIVE FILTER EMI 10uF 4V AUTO 0603; Part Reference: FL142; Mfr_part_number: NFM18HC106D0G_TI; Mfr_name: MURATA; Mistral Part No: 130018100049; Custom_Duty: 15%; Customs_HS_Code: 85412900; Wattage: NA; Project: TI_J7ES_EVM_SOM; Value: 10uF; Footprint Path: Y:\MIS_DATABASE\Library\ALTIUM_TOOL\PCB_FOOTPRINTS\Altium_Footprint_Lib.PcbLib; Library Path: Y:\MIS_DATABASE\Library\ALTIUM_TOOL\SCHEMATICS_PARTS\MS_FILTER_Library.schlib; MECHANICAL 3D STEP FILE: EMIFIL_NFM18C_0603_0-7_TI; RoHS: NA; Chkd/date: MANIRAJA/251018; Crtd /date: ALVY/251018; Datasheet: Y:\MIS_DATABASE\DATASHEETS\DISCRETES\INDUCTORS\NFM18HC-SER.PDF; Temperature: NA; Weight: NA; Height: 0.70MM; PCB Footprint: EMIFIL_NFM18C_0603_0-7_TI; Library Ref: CAP_NFM_TI; Distributor_part_number: NA; Distributor_name: NA; Package: 0603; Voltage: 4V; Tolerance: NA; Part_type: FILTER; Footprint Ref: EMIFIL_NFM18C_0603_0-7_TI
FL143 = CAP_NFM_TI: PASSIVE FILTER EMI 10uF 4V AUTO 0603; Part Reference: FL143; Mfr_part_number: NFM18HC106D0G_TI; Mfr_name: MURATA; Mistral Part No: 130018100049; Custom_Duty: 15%; Customs_HS_Code: 85412900; Wattage: NA; Project: TI_J7ES_EVM_SOM; Value: 10uF; Footprint Path: Y:\MIS_DATABASE\Library\ALTIUM_TOOL\PCB_FOOTPRINTS\Altium_Footprint_Lib.PcbLib; Library Path: Y:\MIS_DATABASE\Library\ALTIUM_TOOL\SCHEMATICS_PARTS\MS_FILTER_Library.schlib; MECHANICAL 3D STEP FILE: EMIFIL_NFM18C_0603_0-7_TI; RoHS: NA; Chkd/date: MANIRAJA/251018; Crtd /date: ALVY/251018; Datasheet: Y:\MIS_DATABASE\DATASHEETS\DISCRETES\INDUCTORS\NFM18HC-SER.PDF; Temperature: NA; Weight: NA; Height: 0.70MM; PCB Footprint: EMIFIL_NFM18C_0603_0-7_TI; Library Ref: CAP_NFM_TI; Distributor_part_number: NA; Distributor_name: NA; Package: 0603; Voltage: 4V; Tolerance: NA; Part_type: FILTER; Footprint Ref: EMIFIL_NFM18C_0603_0-7_TI
FL144 = CAP_NFM_TI: PASSIVE FILTER EMI 1uF 4V AUTO 0402; Part Reference: FL144; Mfr_part_number: NFM15HC105D0G_TI; Mfr_name: MURATA; Mistral Part No: 130018100050; Custom_Duty: 15%; Customs_HS_Code: 85412900; Wattage: NA; Project: TI_J7ES_EVM_SOM; Value: 1uF; Footprint Path: Y:\MIS_DATABASE\Library\ALTIUM_TOOL\PCB_FOOTPRINTS\Altium_Footprint_Lib.PcbLib; Library Path: Y:\MIS_DATABASE\Library\ALTIUM_TOOL\SCHEMATICS_PARTS\MS_FILTER_Library.schlib; MECHANICAL 3D STEP FILE: EMIFIL_NFM15CC_0402_0-5_TI; RoHS: NA; Chkd/date: MANIRAJA/251018; Crtd /date: ALVY/251018; Datasheet: Y:\MIS_DATABASE\DATASHEETS\DISCRETES\INDUCTORS\NFM15CC223C1A3.PDF; Temperature: NA; Weight: NA; Height: 0.50MM; PCB Footprint: EMIFIL_NFM15CC_0402_0-5_TI; Library Ref: CAP_NFM_TI; Distributor_part_number: NA; Distributor_name: NA; Package: 0402; Voltage: 4V; Tolerance: NA; Part_type: FILTER; Footprint Ref: EMIFIL_NFM15CC_0402_0-5_TI
FL145 = CAP_NFM_TI: PASSIVE FILTER EMI 10uF 4V AUTO 0603; Part Reference: FL145; Mfr_part_number: NFM18HC106D0G_TI; Mfr_name: MURATA; Mistral Part No: 130018100049; Custom_Duty: 15%; Customs_HS_Code: 85412900; Wattage: NA; Project: TI_J7ES_EVM_SOM; Value: 10uF; Footprint Path: Y:\MIS_DATABASE\Library\ALTIUM_TOOL\PCB_FOOTPRINTS\Altium_Footprint_Lib.PcbLib; Library Path: Y:\MIS_DATABASE\Library\ALTIUM_TOOL\SCHEMATICS_PARTS\MS_FILTER_Library.schlib; MECHANICAL 3D STEP FILE: EMIFIL_NFM18C_0603_0-7_TI; RoHS: NA; Chkd/date: MANIRAJA/251018; Crtd /date: ALVY/251018; Datasheet: Y:\MIS_DATABASE\DATASHEETS\DISCRETES\INDUCTORS\NFM18HC-SER.PDF; Temperature: NA; Weight: NA; Height: 0.70MM; PCB Footprint: EMIFIL_NFM18C_0603_0-7_TI; Library Ref: CAP_NFM_TI; Distributor_part_number: NA; Distributor_name: NA; Package: 0603; Voltage: 4V; Tolerance: NA; Part_type: FILTER; Footprint Ref: EMIFIL_NFM18C_0603_0-7_TI
FL146 = CAP_NFM_TI: PASSIVE FILTER EMI 1uF 4V AUTO 0402; Part Reference: FL146; Mfr_part_number: NFM15HC105D0G_TI; Mfr_name: MURATA; Mistral Part No: 130018100050; Custom_Duty: 15%; Customs_HS_Code: 85412900; Wattage: NA; Project: TI_J7ES_EVM_SOM; Value: 1uF; Footprint Path: Y:\MIS_DATABASE\Library\ALTIUM_TOOL\PCB_FOOTPRINTS\Altium_Footprint_Lib.PcbLib; Library Path: Y:\MIS_DATABASE\Library\ALTIUM_TOOL\SCHEMATICS_PARTS\MS_FILTER_Library.schlib; MECHANICAL 3D STEP FILE: EMIFIL_NFM15CC_0402_0-5_TI; RoHS: NA; Chkd/date: MANIRAJA/251018; Crtd /date: ALVY/251018; Datasheet: Y:\MIS_DATABASE\DATASHEETS\DISCRETES\INDUCTORS\NFM15CC223C1A3.PDF; Temperature: NA; Weight: NA; Height: 0.50MM; PCB Footprint: EMIFIL_NFM15CC_0402_0-5_TI; Library Ref: CAP_NFM_TI; Distributor_part_number: NA; Distributor_name: NA; Package: 0402; Voltage: 4V; Tolerance: NA; Part_type: FILTER; Footprint Ref: EMIFIL_NFM15CC_0402_0-5_TI
FL147 = CAP_NFM_TI: PASSIVE FILTER EMI 1uF 4V AUTO 0402; Part Reference: FL147; Mfr_part_number: NFM15HC105D0G_TI; Mfr_name: MURATA; Mistral Part No: 130018100050; Custom_Duty: 15%; Customs_HS_Code: 85412900; Wattage: NA; Project: TI_J7ES_EVM_SOM; Value: 1uF; Footprint Path: Y:\MIS_DATABASE\Library\ALTIUM_TOOL\PCB_FOOTPRINTS\Altium_Footprint_Lib.PcbLib; Library Path: Y:\MIS_DATABASE\Library\ALTIUM_TOOL\SCHEMATICS_PARTS\MS_FILTER_Library.schlib; MECHANICAL 3D STEP FILE: EMIFIL_NFM15CC_0402_0-5_TI; RoHS: NA; Chkd/date: MANIRAJA/251018; Crtd /date: ALVY/251018; Datasheet: Y:\MIS_DATABASE\DATASHEETS\DISCRETES\INDUCTORS\NFM15CC223C1A3.PDF; Temperature: NA; Weight: NA; Height: 0.50MM; PCB Footprint: EMIFIL_NFM15CC_0402_0-5_TI; Library Ref: CAP_NFM_TI; Distributor_part_number: NA; Distributor_name: NA; Package: 0402; Voltage: 4V; Tolerance: NA; Part_type: FILTER; Footprint Ref: EMIFIL_NFM15CC_0402_0-5_TI
FL148 = CAP_NFM_TI: PASSIVE FILTER EMI 1uF 4V AUTO 0402; Part Reference: FL148; Mfr_part_number: NFM15HC105D0G_TI; Mfr_name: MURATA; Mistral Part No: 130018100050; Custom_Duty: 15%; Customs_HS_Code: 85412900; Wattage: NA; Project: TI_J7ES_EVM_SOM; Value: 1uF; Footprint Path: Y:\MIS_DATABASE\Library\ALTIUM_TOOL\PCB_FOOTPRINTS\Altium_Footprint_Lib.PcbLib; Library Path: Y:\MIS_DATABASE\Library\ALTIUM_TOOL\SCHEMATICS_PARTS\MS_FILTER_Library.schlib; MECHANICAL 3D STEP FILE: EMIFIL_NFM15CC_0402_0-5_TI; RoHS: NA; Chkd/date: MANIRAJA/251018; Crtd /date: ALVY/251018; Datasheet: Y:\MIS_DATABASE\DATASHEETS\DISCRETES\INDUCTORS\NFM15CC223C1A3.PDF; Temperature: NA; Weight: NA; Height: 0.50MM; PCB Footprint: EMIFIL_NFM15CC_0402_0-5_TI; Library Ref: CAP_NFM_TI; Distributor_part_number: NA; Distributor_name: NA; Package: 0402; Voltage: 4V; Tolerance: NA; Part_type: FILTER; Footprint Ref: EMIFIL_NFM15CC_0402_0-5_TI
FL149 = CAP_NFM_TI: PASSIVE FILTER EMI 1uF 4V AUTO 0402; Part Reference: FL149; Mfr_part_number: NFM15HC105D0G_TI; Mfr_name: MURATA; Mistral Part No: 130018100050; Custom_Duty: 15%; Customs_HS_Code: 85412900; Wattage: NA; Project: TI_J7ES_EVM_SOM; Value: 1uF; Footprint Path: Y:\MIS_DATABASE\Library\ALTIUM_TOOL\PCB_FOOTPRINTS\Altium_Footprint_Lib.PcbLib; Library Path: Y:\MIS_DATABASE\Library\ALTIUM_TOOL\SCHEMATICS_PARTS\MS_FILTER_Library.schlib; MECHANICAL 3D STEP FILE: EMIFIL_NFM15CC_0402_0-5_TI; RoHS: NA; Chkd/date: MANIRAJA/251018; Crtd /date: ALVY/251018; Datasheet: Y:\MIS_DATABASE\DATASHEETS\DISCRETES\INDUCTORS\NFM15CC223C1A3.PDF; Temperature: NA; Weight: NA; Height: 0.50MM; PCB Footprint: EMIFIL_NFM15CC_0402_0-5_TI; Library Ref: CAP_NFM_TI; Distributor_part_number: NA; Distributor_name: NA; Package: 0402; Voltage: 4V; Tolerance: NA; Part_type: FILTER; Footprint Ref: EMIFIL_NFM15CC_0402_0-5_TI
FL150 = CAP_NFM_TI: PASSIVE FILTER EMI 1uF 4V AUTO 0402; Part Reference: FL150; Mfr_part_number: NFM15HC105D0G_TI; Mfr_name: MURATA; Mistral Part No: 130018100050; Custom_Duty: 15%; Customs_HS_Code: 85412900; Wattage: NA; Project: TI_J7ES_EVM_SOM; Value: 1uF; Footprint Path: Y:\MIS_DATABASE\Library\ALTIUM_TOOL\PCB_FOOTPRINTS\Altium_Footprint_Lib.PcbLib; Library Path: Y:\MIS_DATABASE\Library\ALTIUM_TOOL\SCHEMATICS_PARTS\MS_FILTER_Library.schlib; MECHANICAL 3D STEP FILE: EMIFIL_NFM15CC_0402_0-5_TI; RoHS: NA; Chkd/date: MANIRAJA/251018; Crtd /date: ALVY/251018; Datasheet: Y:\MIS_DATABASE\DATASHEETS\DISCRETES\INDUCTORS\NFM15CC223C1A3.PDF; Temperature: NA; Weight: NA; Height: 0.50MM; PCB Footprint: EMIFIL_NFM15CC_0402_0-5_TI; Library Ref: CAP_NFM_TI; Distributor_part_number: NA; Distributor_name: NA; Package: 0402; Voltage: 4V; Tolerance: NA; Part_type: FILTER; Footprint Ref: EMIFIL_NFM15CC_0402_0-5_TI
FL151 = CAP_NFM_TI: PASSIVE FILTER EMI 1uF 4V AUTO 0402; Part Reference: FL151; Mfr_part_number: NFM15HC105D0G_TI; Mfr_name: MURATA; Mistral Part No: 130018100050; Custom_Duty: 15%; Customs_HS_Code: 85412900; Wattage: NA; Project: TI_J7ES_EVM_SOM; Value: 1uF; Footprint Path: Y:\MIS_DATABASE\Library\ALTIUM_TOOL\PCB_FOOTPRINTS\Altium_Footprint_Lib.PcbLib; Library Path: Y:\MIS_DATABASE\Library\ALTIUM_TOOL\SCHEMATICS_PARTS\MS_FILTER_Library.schlib; MECHANICAL 3D STEP FILE: EMIFIL_NFM15CC_0402_0-5_TI; RoHS: NA; Chkd/date: MANIRAJA/251018; Crtd /date: ALVY/251018; Datasheet: Y:\MIS_DATABASE\DATASHEETS\DISCRETES\INDUCTORS\NFM15CC223C1A3.PDF; Temperature: NA; Weight: NA; Height: 0.50MM; PCB Footprint: EMIFIL_NFM15CC_0402_0-5_TI; Library Ref: CAP_NFM_TI; Distributor_part_number: NA; Distributor_name: NA; Package: 0402; Voltage: 4V; Tolerance: NA; Part_type: FILTER; Footprint Ref: EMIFIL_NFM15CC_0402_0-5_TI
FL152 = CAP_NFM_TI: PASSIVE FILTER EMI 10uF 4V AUTO 0603; Part Reference: FL152; Mfr_part_number: NFM18HC106D0G_TI; Mfr_name: MURATA; Mistral Part No: 130018100049; Custom_Duty: 15%; Customs_HS_Code: 85412900; Wattage: NA; Project: TI_J7ES_EVM_SOM; Value: 10uF; Footprint Path: Y:\MIS_DATABASE\Library\ALTIUM_TOOL\PCB_FOOTPRINTS\Altium_Footprint_Lib.PcbLib; Library Path: Y:\MIS_DATABASE\Library\ALTIUM_TOOL\SCHEMATICS_PARTS\MS_FILTER_Library.schlib; MECHANICAL 3D STEP FILE: EMIFIL_NFM18C_0603_0-7_TI; RoHS: NA; Chkd/date: MANIRAJA/251018; Crtd /date: ALVY/251018; Datasheet: Y:\MIS_DATABASE\DATASHEETS\DISCRETES\INDUCTORS\NFM18HC-SER.PDF; Temperature: NA; Weight: NA; Height: 0.70MM; PCB Footprint: EMIFIL_NFM18C_0603_0-7_TI; Library Ref: CAP_NFM_TI; Distributor_part_number: NA; Distributor_name: NA; Package: 0603; Voltage: 4V; Tolerance: NA; Part_type: FILTER; Footprint Ref: EMIFIL_NFM18C_0603_0-7_TI
FL153 = CAP_NFM_TI: PASSIVE FILTER EMI 1uF 4V AUTO 0402; Part Reference: FL153; Mfr_part_number: NFM15HC105D0G_TI; Mfr_name: MURATA; Mistral Part No: 130018100050; Custom_Duty: 15%; Customs_HS_Code: 85412900; Wattage: NA; Project: TI_J7ES_EVM_SOM; Value: 1uF; Footprint Path: Y:\MIS_DATABASE\Library\ALTIUM_TOOL\PCB_FOOTPRINTS\Altium_Footprint_Lib.PcbLib; Library Path: Y:\MIS_DATABASE\Library\ALTIUM_TOOL\SCHEMATICS_PARTS\MS_FILTER_Library.schlib; MECHANICAL 3D STEP FILE: EMIFIL_NFM15CC_0402_0-5_TI; RoHS: NA; Chkd/date: MANIRAJA/251018; Crtd /date: ALVY/251018; Datasheet: Y:\MIS_DATABASE\DATASHEETS\DISCRETES\INDUCTORS\NFM15CC223C1A3.PDF; Temperature: NA; Weight: NA; Height: 0.50MM; PCB Footprint: EMIFIL_NFM15CC_0402_0-5_TI; Library Ref: CAP_NFM_TI; Distributor_part_number: NA; Distributor_name: NA; Package: 0402; Voltage: 4V; Tolerance: NA; Part_type: FILTER; Footprint Ref: EMIFIL_NFM15CC_0402_0-5_TI
FL154 = CAP_NFM_TI: PASSIVE FILTER EMI 10uF 4V AUTO 0603; Part Reference: FL154; Mfr_part_number: NFM18HC106D0G_TI; Mfr_name: MURATA; Mistral Part No: 130018100049; Custom_Duty: 15%; Customs_HS_Code: 85412900; Wattage: NA; Project: TI_J7ES_EVM_SOM; Value: 10uF; Footprint Path: Y:\MIS_DATABASE\Library\ALTIUM_TOOL\PCB_FOOTPRINTS\Altium_Footprint_Lib.PcbLib; Library Path: Y:\MIS_DATABASE\Library\ALTIUM_TOOL\SCHEMATICS_PARTS\MS_FILTER_Library.schlib; MECHANICAL 3D STEP FILE: EMIFIL_NFM18C_0603_0-7_TI; RoHS: NA; Chkd/date: MANIRAJA/251018; Crtd /date: ALVY/251018; Datasheet: Y:\MIS_DATABASE\DATASHEETS\DISCRETES\INDUCTORS\NFM18HC-SER.PDF; Temperature: NA; Weight: NA; Height: 0.70MM; PCB Footprint: EMIFIL_NFM18C_0603_0-7_TI; Library Ref: CAP_NFM_TI; Distributor_part_number: NA; Distributor_name: NA; Package: 0603; Voltage: 4V; Tolerance: NA; Part_type: FILTER; Footprint Ref: EMIFIL_NFM18C_0603_0-7_TI
FL155 = CAP_NFM_TI: PASSIVE FILTER EMI 1uF 4V AUTO 0402; Part Reference: FL155; Mfr_part_number: NFM15HC105D0G_TI; Mfr_name: MURATA; Mistral Part No: 130018100050; Custom_Duty: 15%; Customs_HS_Code: 85412900; Wattage: NA; Project: TI_J7ES_EVM_SOM; Value: 1uF; Footprint Path: Y:\MIS_DATABASE\Library\ALTIUM_TOOL\PCB_FOOTPRINTS\Altium_Footprint_Lib.PcbLib; Library Path: Y:\MIS_DATABASE\Library\ALTIUM_TOOL\SCHEMATICS_PARTS\MS_FILTER_Library.schlib; MECHANICAL 3D STEP FILE: EMIFIL_NFM15CC_0402_0-5_TI; RoHS: NA; Chkd/date: MANIRAJA/251018; Crtd /date: ALVY/251018; Datasheet: Y:\MIS_DATABASE\DATASHEETS\DISCRETES\INDUCTORS\NFM15CC223C1A3.PDF; Temperature: NA; Weight: NA; Height: 0.50MM; PCB Footprint: EMIFIL_NFM15CC_0402_0-5_TI; Library Ref: CAP_NFM_TI; Distributor_part_number: NA; Distributor_name: NA; Package: 0402; Voltage: 4V; Tolerance: NA; Part_type: FILTER; Footprint Ref: EMIFIL_NFM15CC_0402_0-5_TI
FL158 = CAP_NFM_TI: PASSIVE FILTER EMI 1uF 4V AUTO 0402; Part Reference: FL158; Mfr_part_number: NFM15HC105D0G_TI; Mfr_name: MURATA; Mistral Part No: 130018100050; Custom_Duty: 15%; Customs_HS_Code: 85412900; Wattage: NA; Project: TI_J7ES_EVM_SOM; Value: 1uF; Footprint Path: Y:\MIS_DATABASE\Library\ALTIUM_TOOL\PCB_FOOTPRINTS\Altium_Footprint_Lib.PcbLib; Library Path: Y:\MIS_DATABASE\Library\ALTIUM_TOOL\SCHEMATICS_PARTS\MS_FILTER_Library.schlib; MECHANICAL 3D STEP FILE: EMIFIL_NFM15CC_0402_0-5_TI; RoHS: NA; Chkd/date: MANIRAJA/251018; Crtd /date: ALVY/251018; Datasheet: Y:\MIS_DATABASE\DATASHEETS\DISCRETES\INDUCTORS\NFM15CC223C1A3.PDF; Temperature: NA; Weight: NA; Height: 0.50MM; PCB Footprint: EMIFIL_NFM15CC_0402_0-5_TI; Library Ref: CAP_NFM_TI; Distributor_part_number: NA; Distributor_name: NA; Package: 0402; Voltage: 4V; Tolerance: NA; Part_type: FILTER; Footprint Ref: EMIFIL_NFM15CC_0402_0-5_TI
FL159 = CAP_NFM_TI: PASSIVE FILTER EMI 1uF 4V AUTO 0402; Part Reference: FL159; Mfr_part_number: NFM15HC105D0G_TI; Mfr_name: MURATA; Mistral Part No: 130018100050; Custom_Duty: 15%; Customs_HS_Code: 85412900; Wattage: NA; Project: TI_J7ES_EVM_SOM; Value: 1uF; Footprint Path: Y:\MIS_DATABASE\Library\ALTIUM_TOOL\PCB_FOOTPRINTS\Altium_Footprint_Lib.PcbLib; Library Path: Y:\MIS_DATABASE\Library\ALTIUM_TOOL\SCHEMATICS_PARTS\MS_FILTER_Library.schlib; MECHANICAL 3D STEP FILE: EMIFIL_NFM15CC_0402_0-5_TI; RoHS: NA; Chkd/date: MANIRAJA/251018; Crtd /date: ALVY/251018; Datasheet: Y:\MIS_DATABASE\DATASHEETS\DISCRETES\INDUCTORS\NFM15CC223C1A3.PDF; Temperature: NA; Weight: NA; Height: 0.50MM; PCB Footprint: EMIFIL_NFM15CC_0402_0-5_TI; Library Ref: CAP_NFM_TI; Distributor_part_number: NA; Distributor_name: NA; Package: 0402; Voltage: 4V; Tolerance: NA; Part_type: FILTER; Footprint Ref: EMIFIL_NFM15CC_0402_0-5_TI
FL160 = CAP_NFM_TI: PASSIVE FILTER EMI 1uF 4V AUTO 0402; Part Reference: FL160; Mfr_part_number: NFM15HC105D0G_TI; Mfr_name: MURATA; Mistral Part No: 130018100050; Custom_Duty: 15%; Customs_HS_Code: 85412900; Wattage: NA; Project: TI_J7ES_EVM_SOM; Value: 1uF; Footprint Path: Y:\MIS_DATABASE\Library\ALTIUM_TOOL\PCB_FOOTPRINTS\Altium_Footprint_Lib.PcbLib; Library Path: Y:\MIS_DATABASE\Library\ALTIUM_TOOL\SCHEMATICS_PARTS\MS_FILTER_Library.schlib; MECHANICAL 3D STEP FILE: EMIFIL_NFM15CC_0402_0-5_TI; RoHS: NA; Chkd/date: MANIRAJA/251018; Crtd /date: ALVY/251018; Datasheet: Y:\MIS_DATABASE\DATASHEETS\DISCRETES\INDUCTORS\NFM15CC223C1A3.PDF; Temperature: NA; Weight: NA; Height: 0.50MM; PCB Footprint: EMIFIL_NFM15CC_0402_0-5_TI; Library Ref: CAP_NFM_TI; Distributor_part_number: NA; Distributor_name: NA; Package: 0402; Voltage: 4V; Tolerance: NA; Part_type: FILTER; Footprint Ref: EMIFIL_NFM15CC_0402_0-5_TI
FL161 = CAP_NFM_TI: PASSIVE FILTER EMI 1uF 4V AUTO 0402; Part Reference: FL161; Mfr_part_number: NFM15HC105D0G_TI; Mfr_name: MURATA; Mistral Part No: 130018100050; Custom_Duty: 15%; Customs_HS_Code: 85412900; Wattage: NA; Project: TI_J7ES_EVM_SOM; Value: 1uF; Footprint Path: Y:\MIS_DATABASE\Library\ALTIUM_TOOL\PCB_FOOTPRINTS\Altium_Footprint_Lib.PcbLib; Library Path: Y:\MIS_DATABASE\Library\ALTIUM_TOOL\SCHEMATICS_PARTS\MS_FILTER_Library.schlib; MECHANICAL 3D STEP FILE: EMIFIL_NFM15CC_0402_0-5_TI; RoHS: NA; Chkd/date: MANIRAJA/251018; Crtd /date: ALVY/251018; Datasheet: Y:\MIS_DATABASE\DATASHEETS\DISCRETES\INDUCTORS\NFM15CC223C1A3.PDF; Temperature: NA; Weight: NA; Height: 0.50MM; PCB Footprint: EMIFIL_NFM15CC_0402_0-5_TI; Library Ref: CAP_NFM_TI; Distributor_part_number: NA; Distributor_name: NA; Package: 0402; Voltage: 4V; Tolerance: NA; Part_type: FILTER; Footprint Ref: EMIFIL_NFM15CC_0402_0-5_TI
FL162 = CAP_NFM_TI: PASSIVE FILTER EMI 1uF 4V AUTO 0402; Part Reference: FL162; Mfr_part_number: NFM15HC105D0G_TI; Mfr_name: MURATA; Mistral Part No: 130018100050; Custom_Duty: 15%; Customs_HS_Code: 85412900; Wattage: NA; Project: TI_J7ES_EVM_SOM; Value: 1uF; Footprint Path: Y:\MIS_DATABASE\Library\ALTIUM_TOOL\PCB_FOOTPRINTS\Altium_Footprint_Lib.PcbLib; Library Path: Y:\MIS_DATABASE\Library\ALTIUM_TOOL\SCHEMATICS_PARTS\MS_FILTER_Library.schlib; MECHANICAL 3D STEP FILE: EMIFIL_NFM15CC_0402_0-5_TI; RoHS: NA; Chkd/date: MANIRAJA/251018; Crtd /date: ALVY/251018; Datasheet: Y:\MIS_DATABASE\DATASHEETS\DISCRETES\INDUCTORS\NFM15CC223C1A3.PDF; Temperature: NA; Weight: NA; Height: 0.50MM; PCB Footprint: EMIFIL_NFM15CC_0402_0-5_TI; Library Ref: CAP_NFM_TI; Distributor_part_number: NA; Distributor_name: NA; Package: 0402; Voltage: 4V; Tolerance: NA; Part_type: FILTER; Footprint Ref: EMIFIL_NFM15CC_0402_0-5_TI
FL163 = CAP_NFM_TI: PASSIVE FILTER EMI 1uF 4V AUTO 0402; Part Reference: FL163; Mfr_part_number: NFM15HC105D0G_TI; Mfr_name: MURATA; Mistral Part No: 130018100050; Custom_Duty: 15%; Customs_HS_Code: 85412900; Wattage: NA; Project: TI_J7ES_EVM_SOM; Value: 1uF; Footprint Path: Y:\MIS_DATABASE\Library\ALTIUM_TOOL\PCB_FOOTPRINTS\Altium_Footprint_Lib.PcbLib; Library Path: Y:\MIS_DATABASE\Library\ALTIUM_TOOL\SCHEMATICS_PARTS\MS_FILTER_Library.schlib; MECHANICAL 3D STEP FILE: EMIFIL_NFM15CC_0402_0-5_TI; RoHS: NA; Chkd/date: MANIRAJA/251018; Crtd /date: ALVY/251018; Datasheet: Y:\MIS_DATABASE\DATASHEETS\DISCRETES\INDUCTORS\NFM15CC223C1A3.PDF; Temperature: NA; Weight: NA; Height: 0.50MM; PCB Footprint: EMIFIL_NFM15CC_0402_0-5_TI; Library Ref: CAP_NFM_TI; Distributor_part_number: NA; Distributor_name: NA; Package: 0402; Voltage: 4V; Tolerance: NA; Part_type: FILTER; Footprint Ref: EMIFIL_NFM15CC_0402_0-5_TI